# Altium schematic sheet Serial_Hub.SchDoc
size A4
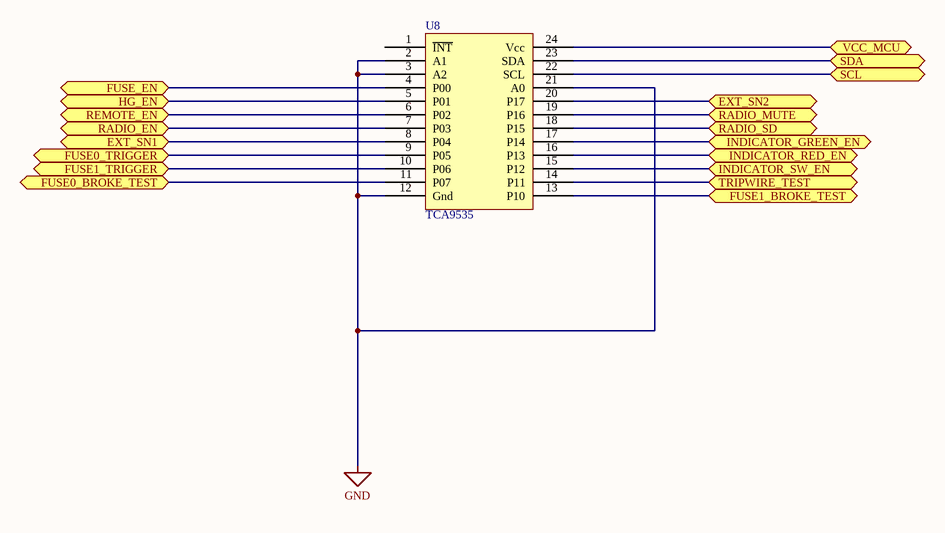
[diagram p0: Serial_Hub.SchDoc]

## Parts
U8  TCA9535  [TSSOP24]

## Ports
EXT_SN1 (bidir), EXT_SN2 (bidir), FUSE0_BROKE_TEST (bidir), FUSE0_TRIGGER (bidir), FUSE1_BROKE_TEST (bidir), FUSE1_TRIGGER (bidir), FUSE_EN (bidir), HG_EN (bidir), INDICATOR_GREEN_EN (bidir), INDICATOR_RED_EN (bidir), INDICATOR_SW_EN (bidir), RADIO_EN (bidir), RADIO_MUTE (bidir), RADIO_SD (bidir), REMOTE_EN (bidir), SCL (bidir), SDA (bidir), TRIPWIRE_TEST (bidir), VCC_MCU (bidir)

## Nets
GND: U8.2(A1) U8.3(A2) U8.12(Gnd) U8.21(A0)
EXT_SN1: U8.8(P04) ; port EXT_SN1
EXT_SN2: U8.20(P17) ; port EXT_SN2
FUSE0_BROKE_TEST: U8.11(P07) ; port FUSE0_BROKE_TEST
FUSE0_TRIGGER: U8.9(P05) ; port FUSE0_TRIGGER
FUSE1_BROKE_TEST: U8.13(P10) ; port FUSE1_BROKE_TEST
FUSE1_TRIGGER: U8.10(P06) ; port FUSE1_TRIGGER
FUSE_EN: U8.4(P00) ; port FUSE_EN
HG_EN: U8.5(P01) ; port HG_EN
INDICATOR_GREEN_EN: U8.17(P14) ; port INDICATOR_GREEN_EN
INDICATOR_RED_EN: U8.16(P13) ; port INDICATOR_RED_EN
INDICATOR_SW_EN: U8.15(P12) ; port INDICATOR_SW_EN
RADIO_EN: U8.7(P03) ; port RADIO_EN
RADIO_MUTE: U8.19(P16) ; port RADIO_MUTE
RADIO_SD: U8.18(P15) ; port RADIO_SD
REMOTE_EN: U8.6(P02) ; port REMOTE_EN
SCL: U8.22(SCL) ; port SCL
SDA: U8.23(SDA) ; port SDA
TRIPWIRE_TEST: U8.14(P11) ; port TRIPWIRE_TEST
VCC_MCU: U8.24(Vcc) ; port VCC_MCU

Not connected (* = marked no-connect by the designer): U8 1(~{INT})